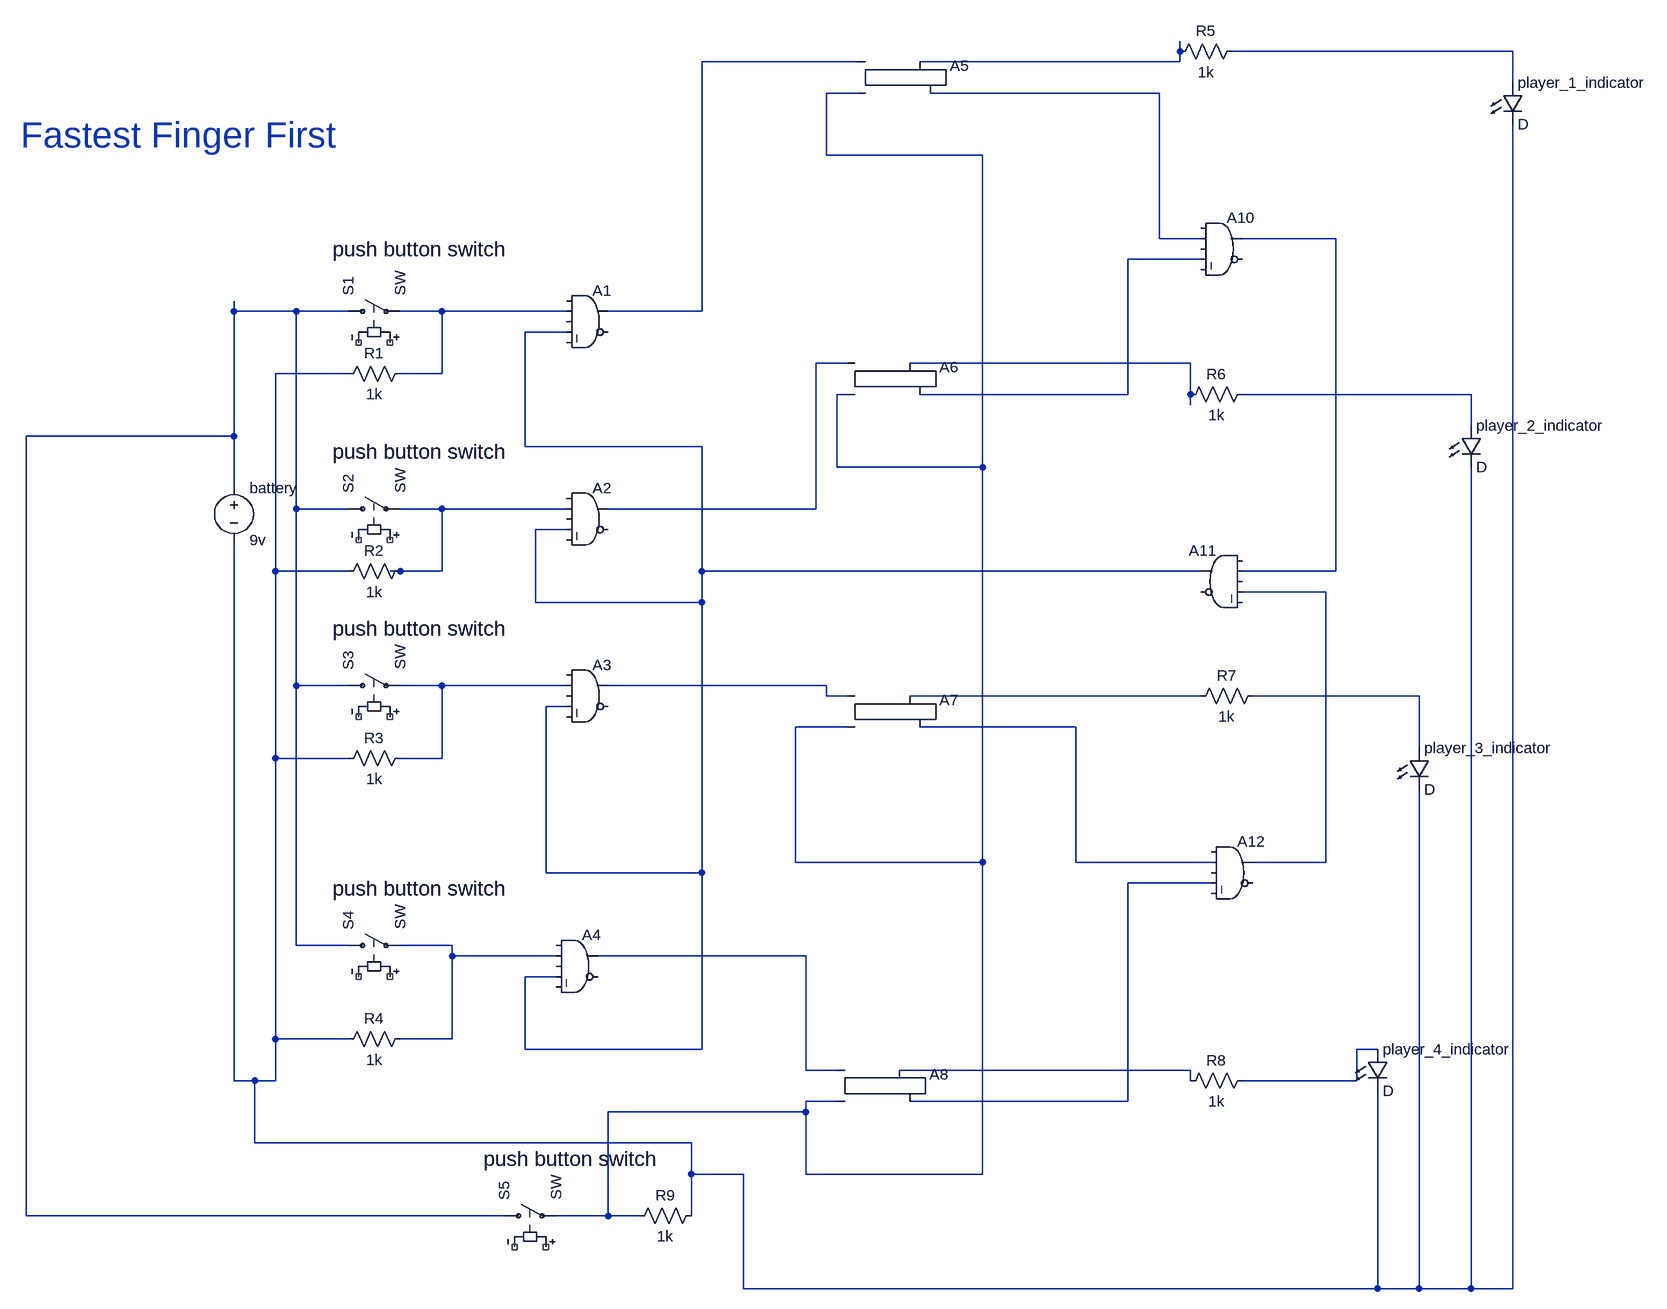
[diagram p0: schematic Draft1.asc]
Draft1.asc, the LTspice schematic file:
Version 4
SHEET 1 2168 1388
WIRE 1408 -544 1408 -560
WIRE 1920 -544 1488 -544
WIRE 912 -528 672 -528
WIRE 1408 -528 1408 -544
WIRE 1408 -528 1008 -528
WIRE 1920 -496 1920 -544
WIRE 912 -480 864 -480
WIRE 1376 -480 1024 -480
WIRE 864 -384 864 -480
WIRE 1104 -384 864 -384
WIRE 1376 -256 1376 -480
WIRE 1440 -256 1376 -256
WIRE 1648 -256 1504 -256
WIRE 1440 -224 1328 -224
WIRE -48 -144 -48 -160
WIRE 48 -144 -48 -144
WIRE 128 -144 48 -144
WIRE 272 -144 208 -144
WIRE 464 -144 272 -144
WIRE 672 -144 672 -528
WIRE 672 -144 528 -144
WIRE 464 -112 400 -112
WIRE 896 -64 848 -64
WIRE 1424 -64 992 -64
WIRE 128 -48 16 -48
WIRE 272 -48 272 -144
WIRE 272 -48 208 -48
WIRE 896 -16 880 -16
WIRE 1328 -16 1328 -224
WIRE 1328 -16 1008 -16
WIRE 1424 -16 1424 -64
WIRE 1856 -16 1504 -16
WIRE 1424 0 1424 -16
WIRE 1856 32 1856 -16
WIRE -48 48 -48 -144
WIRE -48 48 -368 48
WIRE 400 64 400 -112
WIRE 672 64 400 64
WIRE 880 96 880 -16
WIRE 1104 96 1104 -384
WIRE 1104 96 880 96
WIRE -48 128 -48 48
WIRE 48 160 48 -144
WIRE 128 160 48 160
WIRE 272 160 208 160
WIRE 464 160 272 160
WIRE 848 160 848 -64
WIRE 848 160 528 160
WIRE 464 192 416 192
WIRE 16 256 16 -48
WIRE 128 256 16 256
WIRE 208 256 192 256
WIRE 272 256 272 160
WIRE 272 256 208 256
WIRE 672 256 672 64
WIRE 1440 256 672 256
WIRE 1648 256 1648 -256
WIRE 1648 256 1504 256
WIRE 1632 288 1504 288
WIRE 416 304 416 192
WIRE 672 304 672 256
WIRE 672 304 416 304
WIRE 48 432 48 160
WIRE 128 432 48 432
WIRE 272 432 208 432
WIRE 464 432 272 432
WIRE 864 432 528 432
WIRE 864 448 864 432
WIRE 896 448 864 448
WIRE 1440 448 992 448
WIRE 1776 448 1520 448
WIRE 464 464 432 464
WIRE 896 496 816 496
WIRE 1248 496 1008 496
WIRE 1776 528 1776 448
WIRE 16 544 16 256
WIRE 128 544 16 544
WIRE 272 544 272 432
WIRE 272 544 208 544
WIRE 816 704 816 496
WIRE 1104 704 1104 96
WIRE 1104 704 816 704
WIRE 1248 704 1248 496
WIRE 1456 704 1248 704
WIRE 1632 704 1632 288
WIRE 1632 704 1520 704
WIRE 432 720 432 464
WIRE 672 720 672 304
WIRE 672 720 432 720
WIRE 1456 736 1328 736
WIRE 48 832 48 432
WIRE 128 832 48 832
WIRE 288 832 208 832
WIRE 288 848 288 832
WIRE 448 848 288 848
WIRE 832 848 512 848
WIRE 448 880 400 880
WIRE 16 976 16 544
WIRE 128 976 16 976
WIRE 288 976 288 848
WIRE 288 976 208 976
WIRE 400 992 400 880
WIRE 672 992 672 720
WIRE 672 992 400 992
WIRE 1712 992 1680 992
WIRE 832 1024 832 848
WIRE 880 1024 832 1024
WIRE 1424 1024 976 1024
WIRE -48 1040 -48 208
WIRE -16 1040 -48 1040
WIRE 16 1040 16 976
WIRE 16 1040 -16 1040
WIRE 1424 1040 1424 1024
WIRE 1680 1040 1680 992
WIRE 1680 1040 1504 1040
WIRE 880 1072 832 1072
WIRE 1328 1072 1328 736
WIRE 1328 1072 992 1072
WIRE 832 1088 832 1072
WIRE 832 1088 528 1088
WIRE -16 1136 -16 1040
WIRE 656 1136 -16 1136
WIRE 656 1184 656 1136
WIRE 736 1184 656 1184
WIRE 832 1184 832 1088
WIRE 1104 1184 1104 704
WIRE 1104 1184 832 1184
WIRE -368 1248 -368 48
WIRE 368 1248 -368 1248
WIRE 528 1248 528 1088
WIRE 528 1248 448 1248
WIRE 576 1248 528 1248
WIRE 656 1248 656 1184
WIRE 736 1360 736 1184
WIRE 1712 1360 1712 1056
WIRE 1712 1360 736 1360
WIRE 1776 1360 1776 592
WIRE 1776 1360 1712 1360
WIRE 1856 1360 1856 96
WIRE 1856 1360 1776 1360
WIRE 1920 1360 1920 -432
WIRE 1920 1360 1856 1360
SYMBOL voltage -48 112 R0
SYMATTR InstName battery
SYMATTR Value 9v
SYMBOL sw 112 -144 R270
SYMATTR InstName S1
SYMBOL sw 112 160 R270
SYMATTR InstName S2
SYMBOL sw 112 432 R270
SYMATTR InstName S3
SYMBOL sw 112 832 R270
SYMATTR InstName S4
SYMBOL res 224 -64 R90
WINDOW 0 0 56 VBottom 2
WINDOW 3 32 56 VTop 2
SYMATTR InstName R1
SYMATTR Value 1k
SYMBOL res 224 240 R90
WINDOW 0 0 56 VBottom 2
WINDOW 3 32 56 VTop 2
SYMATTR InstName R2
SYMATTR Value 1k
SYMBOL res 224 528 R90
WINDOW 0 0 56 VBottom 2
WINDOW 3 32 56 VTop 2
SYMATTR InstName R3
SYMATTR Value 1k
SYMBOL res 224 960 R90
WINDOW 0 0 56 VBottom 2
WINDOW 3 32 56 VTop 2
SYMATTR InstName R4
SYMATTR Value 1k
SYMBOL Digital\\and 496 -192 R0
SYMATTR InstName A1
SYMBOL Digital\\and 496 112 R0
SYMATTR InstName A2
SYMBOL Digital\\and 496 384 R0
SYMATTR InstName A3
SYMBOL Digital\\and 480 800 R0
SYMATTR InstName A4
SYMBOL Digital\\srflop 960 -576 R0
SYMATTR InstName A5
SYMBOL Digital\\srflop 944 -112 R0
SYMATTR InstName A6
SYMBOL Digital\\srflop 944 400 R0
SYMATTR InstName A7
SYMBOL Digital\\srflop 928 976 R0
SYMATTR InstName A8
SYMBOL res 1504 -560 R90
WINDOW 0 0 56 VBottom 2
WINDOW 3 32 56 VTop 2
SYMATTR InstName R5
SYMATTR Value 1k
SYMBOL res 1520 -32 R90
WINDOW 0 0 56 VBottom 2
WINDOW 3 32 56 VTop 2
SYMATTR InstName R6
SYMATTR Value 1k
SYMBOL res 1536 432 R90
WINDOW 0 0 56 VBottom 2
WINDOW 3 32 56 VTop 2
SYMATTR InstName R7
SYMATTR Value 1k
SYMBOL res 1520 1024 R90
WINDOW 0 0 56 VBottom 2
WINDOW 3 32 56 VTop 2
SYMATTR InstName R8
SYMATTR Value 1k
SYMBOL Digital\\and 1472 -304 R0
SYMATTR InstName A10
SYMBOL Digital\\and 1472 208 M0
SYMATTR InstName A11
SYMBOL Digital\\and 1488 656 R0
SYMATTR InstName A12
SYMBOL LED 1904 -496 R0
SYMATTR InstName player_1_indicator
SYMBOL LED 1840 32 R0
SYMATTR InstName player_2_indicator
SYMBOL LED 1760 528 R0
SYMATTR InstName player_3_indicator
SYMBOL LED 1696 992 R0
SYMATTR InstName player_4_indicator
SYMBOL sw 352 1248 R270
SYMATTR InstName S5
SYMBOL res 672 1232 R90
WINDOW 0 0 56 VBottom 2
WINDOW 3 32 56 VTop 2
SYMATTR InstName R9
SYMATTR Value 1k
TEXT 104 -240 Left 3 !push button switch
TEXT 104 72 Left 3 !push button switch
TEXT 104 344 Left 3 !push button switch
TEXT 104 744 Left 3 !push button switch
TEXT 336 1160 Left 3 !push button switch
TEXT -376 -416 Left 5 ;Fastest Finger First

The netlist it stands for:
* Draft1.asc
V§battery N008 N013 9v
S1 N008 N009 NC_01 NC_02 SW
S2 N008 N015 NC_03 NC_04 SW
S3 N008 N017 NC_05 NC_06 SW
S4 N008 N023 NC_07 NC_08 SW
R1 N009 N013 1k
R2 N015 N013 1k
R3 N017 N013 1k
R4 N023 N013 1k
A1 0 N009 0 N010 0 0 N003 0 AND
A2 0 N015 0 N010 0 0 N011 0 AND
A3 0 N017 0 N010 0 0 N018 0 AND
A4 0 N023 0 N010 0 0 N024 0 AND
A5 N003 N004 0 0 0 N005 N001 0 SRFLOP
A6 N011 N004 0 0 0 N007 N012 0 SRFLOP
A7 N018 N004 0 0 0 N021 N019 0 SRFLOP
A8 N024 N004 0 0 0 N022 N026 0 SRFLOP
R5 N002 N001 1k
R6 N014 N012 1k
R7 N020 N019 1k
R8 N025 N026 1k
A10 0 N005 0 N007 0 0 N006 0 AND
A11 0 N006 0 N016 0 0 N010 0 AND
A12 0 N021 0 N022 0 0 N016 0 AND
D§player_1_indicator N002 N013 D
D§player_2_indicator N014 N013 D
D§player_3_indicator N020 N013 D
D§player_4_indicator N025 N013 D
S5 N008 N004 NC_09 NC_10 SW
R9 N013 N004 1k
.model D D
.lib standard.dio
push button switch
push button switch
push button switch
push button switch
push button switch
* Fastest Finger First
.backanno
.end